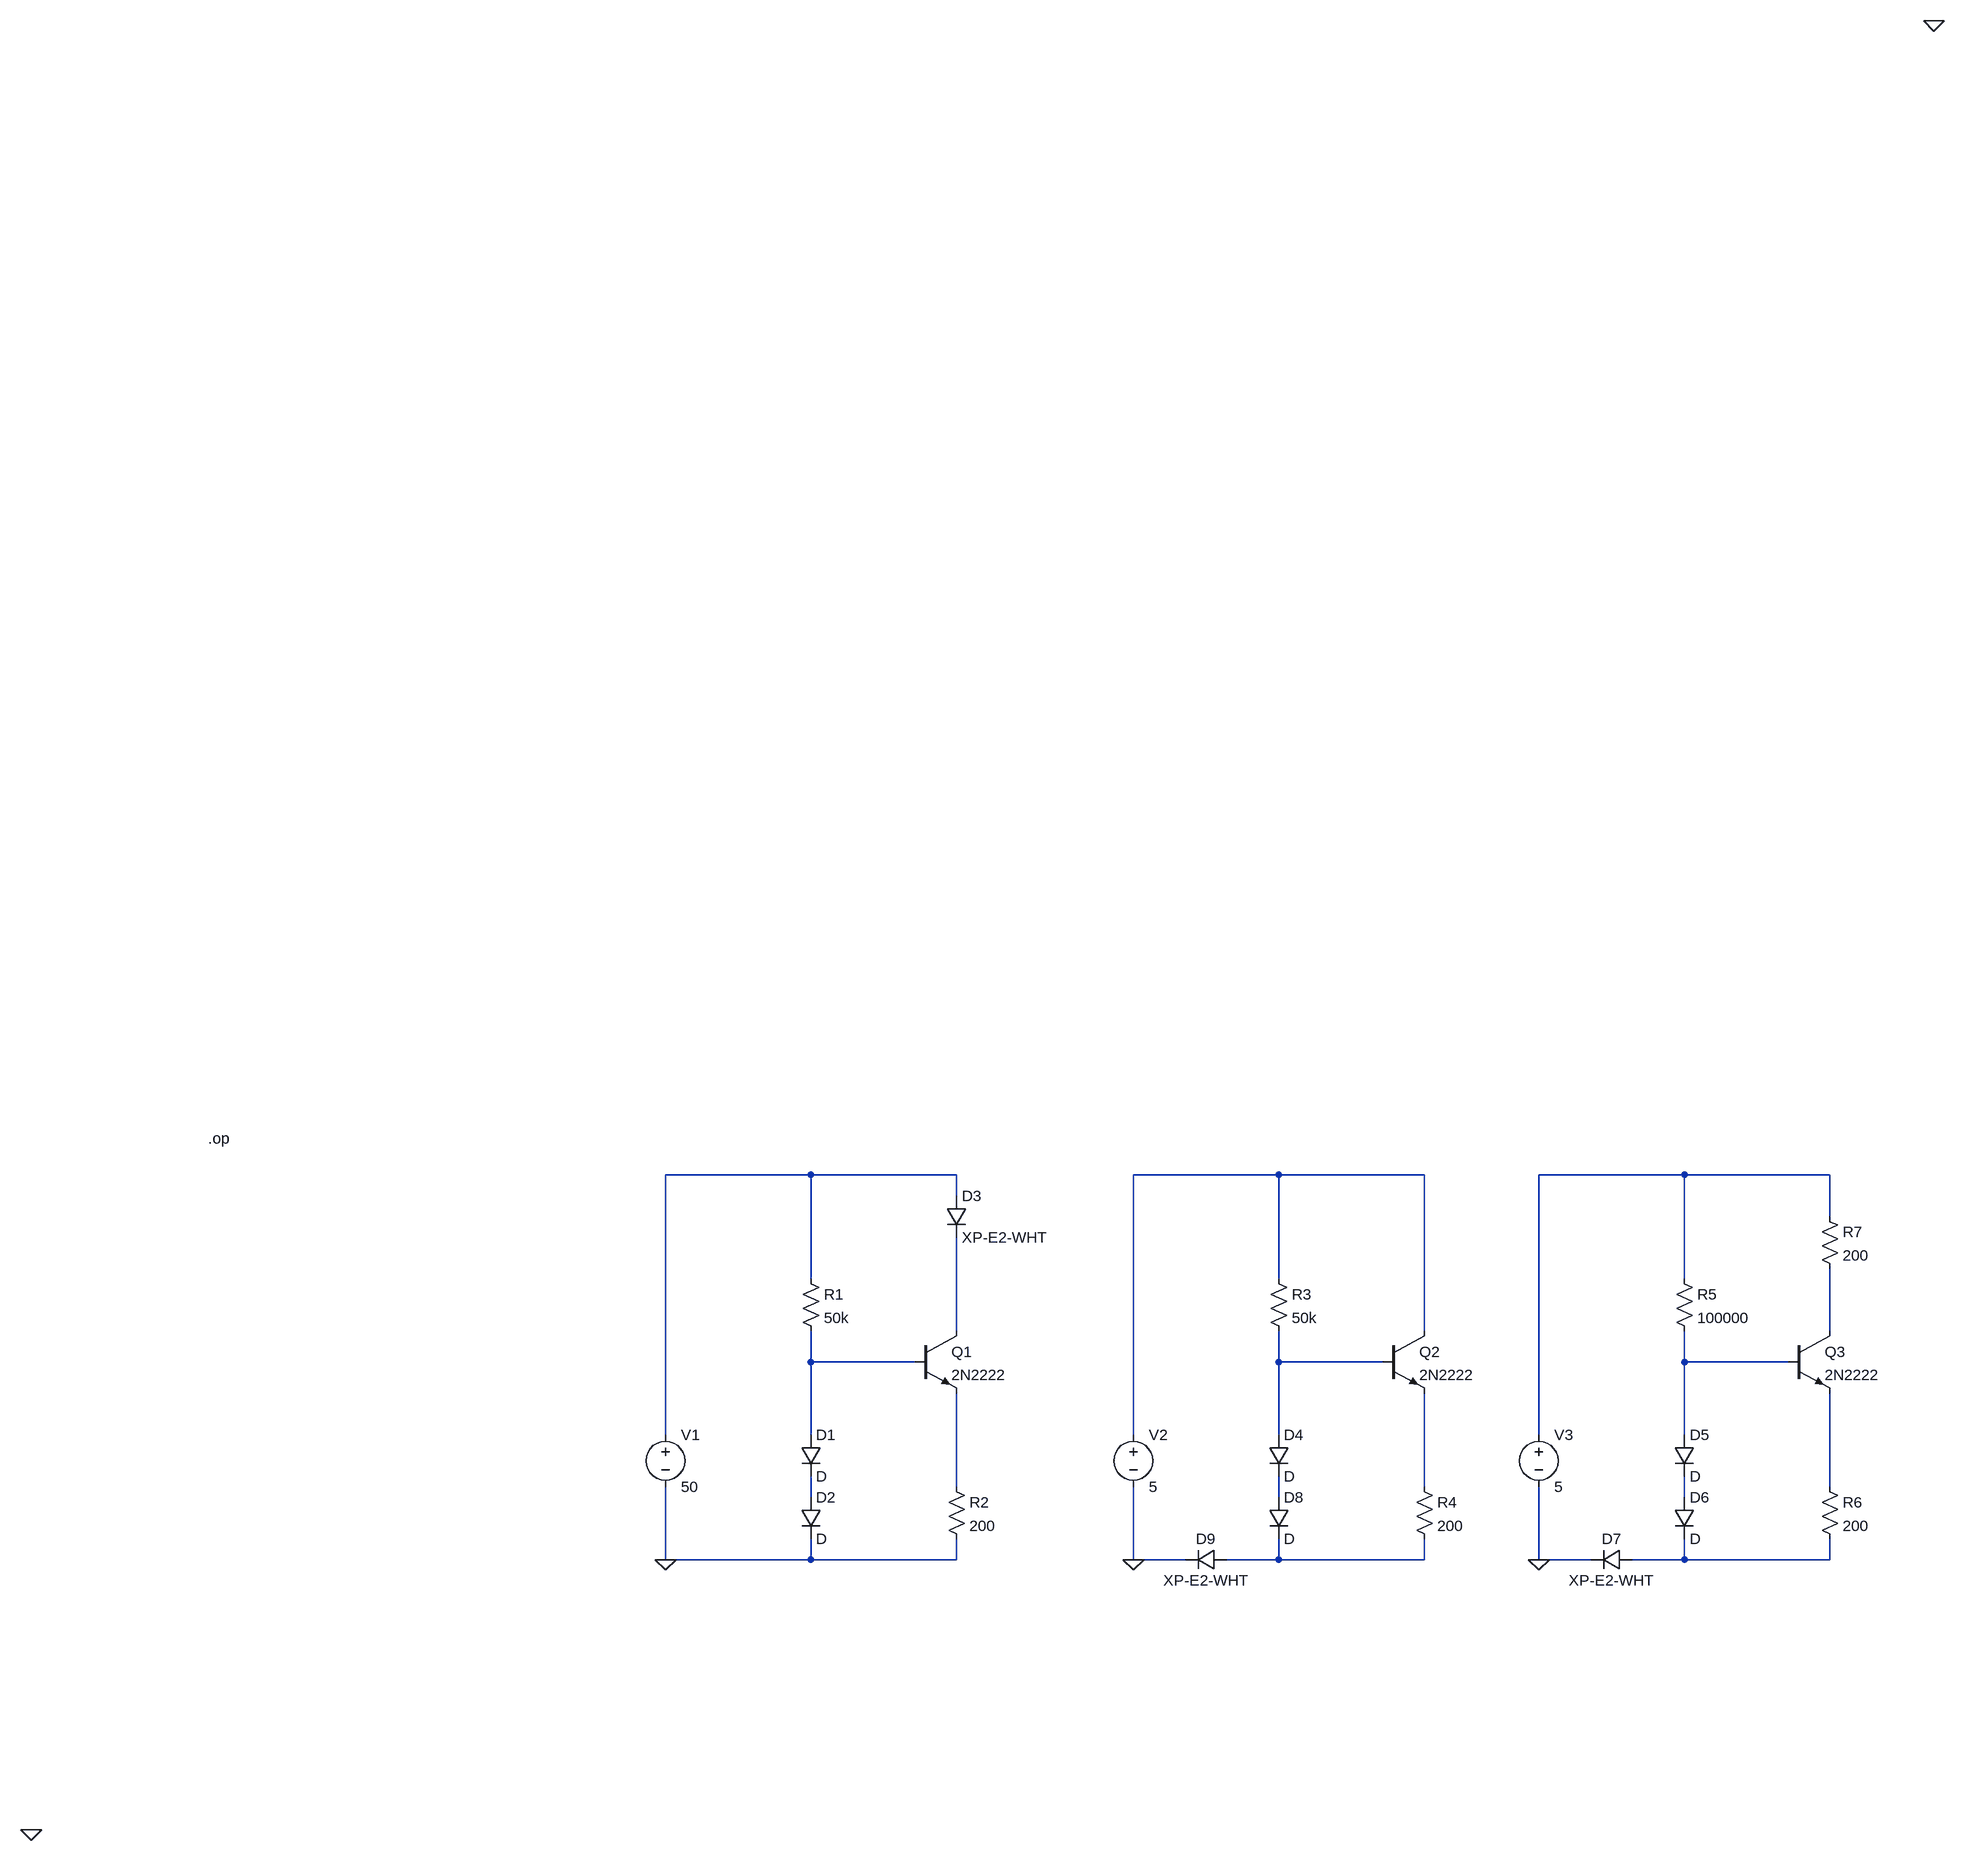
[diagram p0: schematic LED Driving Current Source.asc]
LED Driving Current Source.asc, the LTspice schematic file:
Version 4
SHEET 1 2724 1412
WIRE 976 384 752 384
WIRE 1200 384 976 384
WIRE 1696 384 1472 384
WIRE 1920 384 1696 384
WIRE 2320 384 2096 384
WIRE 2544 384 2320 384
WIRE 1200 416 1200 384
WIRE 2544 448 2544 384
WIRE 976 544 976 384
WIRE 1696 544 1696 384
WIRE 2320 544 2320 384
WIRE 1200 624 1200 480
WIRE 1920 624 1920 384
WIRE 2544 624 2544 528
WIRE 976 672 976 624
WIRE 1136 672 976 672
WIRE 1696 672 1696 624
WIRE 1856 672 1696 672
WIRE 2320 672 2320 624
WIRE 2480 672 2320 672
WIRE 752 784 752 384
WIRE 976 784 976 672
WIRE 1472 784 1472 384
WIRE 1696 784 1696 672
WIRE 2096 784 2096 384
WIRE 2320 784 2320 672
WIRE 1200 864 1200 720
WIRE 1920 864 1920 720
WIRE 2544 864 2544 720
WIRE 976 880 976 848
WIRE 1696 880 1696 848
WIRE 2320 880 2320 848
WIRE 752 976 752 864
WIRE 976 976 976 944
WIRE 976 976 752 976
WIRE 1200 976 1200 944
WIRE 1200 976 976 976
WIRE 1472 976 1472 864
WIRE 1552 976 1472 976
WIRE 1696 976 1696 944
WIRE 1696 976 1616 976
WIRE 1920 976 1920 944
WIRE 1920 976 1696 976
WIRE 2096 976 2096 864
WIRE 2176 976 2096 976
WIRE 2320 976 2320 944
WIRE 2320 976 2240 976
WIRE 2544 976 2544 944
WIRE 2544 976 2320 976
FLAG 2704 -1392 0
FLAG -224 1392 0
FLAG 752 976 0
FLAG 1472 976 0
FLAG 2096 976 0
DATAFLAG 976 416 ""
DATAFLAG 1168 384 ""
DATAFLAG 1200 576 ""
DATAFLAG 1200 816 ""
DATAFLAG 976 736 ""
DATAFLAG 1696 416 ""
DATAFLAG 1888 384 ""
DATAFLAG 1920 576 ""
DATAFLAG 1920 816 ""
DATAFLAG 1696 736 ""
DATAFLAG 1776 976 ""
DATAFLAG 2320 416 ""
DATAFLAG 2512 384 ""
DATAFLAG 2544 576 ""
DATAFLAG 2544 816 ""
DATAFLAG 2320 736 ""
DATAFLAG 2400 976 ""
DATAFLAG 2544 400 ""
SYMBOL res 960 528 R0
SYMATTR InstName R1
SYMATTR Value 50k
SYMBOL voltage 752 768 R0
WINDOW 123 0 0 Left 0
WINDOW 39 0 0 Left 0
SYMATTR InstName V1
SYMATTR Value 50
SYMBOL diode 960 784 R0
SYMATTR InstName D1
SYMBOL diode 960 880 R0
SYMATTR InstName D2
SYMBOL npn 1136 624 R0
SYMATTR InstName Q1
SYMATTR Value 2N2222
SYMBOL res 1184 848 R0
SYMATTR InstName R2
SYMATTR Value 200
SYMBOL diode 1184 416 R0
SYMATTR InstName D3
SYMATTR Value XP-E2-WHT
SYMBOL res 1680 528 R0
SYMATTR InstName R3
SYMATTR Value 50k
SYMBOL voltage 1472 768 R0
WINDOW 123 0 0 Left 0
WINDOW 39 0 0 Left 0
SYMATTR InstName V2
SYMATTR Value 5
SYMBOL diode 1680 784 R0
SYMATTR InstName D4
SYMBOL diode 1680 880 R0
SYMATTR InstName D8
SYMBOL npn 1856 624 R0
SYMATTR InstName Q2
SYMATTR Value 2N2222
SYMBOL res 1904 848 R0
SYMATTR InstName R4
SYMATTR Value 200
SYMBOL diode 1616 960 R90
WINDOW 0 0 32 VBottom 2
WINDOW 3 32 32 VTop 2
SYMATTR InstName D9
SYMATTR Value XP-E2-WHT
SYMBOL res 2304 528 R0
SYMATTR InstName R5
SYMATTR Value 100000
SYMBOL voltage 2096 768 R0
WINDOW 123 0 0 Left 0
WINDOW 39 0 0 Left 0
SYMATTR InstName V3
SYMATTR Value 5
SYMBOL diode 2304 784 R0
SYMATTR InstName D5
SYMBOL diode 2304 880 R0
SYMATTR InstName D6
SYMBOL npn 2480 624 R0
SYMATTR InstName Q3
SYMATTR Value 2N2222
SYMBOL res 2528 848 R0
SYMATTR InstName R6
SYMATTR Value 200
SYMBOL diode 2240 960 R90
WINDOW 0 0 32 VBottom 2
WINDOW 3 32 32 VTop 2
SYMATTR InstName D7
SYMATTR Value XP-E2-WHT
SYMBOL res 2528 432 R0
SYMATTR InstName R7
SYMATTR Value 200
TEXT 48 328 Left 2 !.op

The netlist it stands for:
* LED Driving Current Source.asc
R1 N001 N006 50k
V1 N001 0 50
D1 N006 N012 D
D2 N012 0 D
Q1 N004 N006 N009 0 2N2222
R2 N009 0 200
D3 N001 N004 XP-E2-WHT
R3 N002 N007 50k
V2 N002 0 5
D4 N007 N013 D
D8 N013 N015 D
Q2 N002 N007 N010 0 2N2222
R4 N010 N015 200
D9 N015 0 XP-E2-WHT
R5 N003 N008 100000
V3 N003 0 5
D5 N008 N014 D
D6 N014 N016 D
Q3 N005 N008 N011 0 2N2222
R6 N011 N016 200
D7 N016 0 XP-E2-WHT
R7 N003 N005 200
.model D D
.lib standard.dio
.model NPN NPN
.model PNP PNP
.lib standard.bjt
.op
.backanno
.end